# Altium schematic sheet Ext_Mem.SchDoc
size A4; Organization: Altium Limited; Address1: L3, 12a Rodborough Rd; Address2: Frenchs Forest; Address3: NSW; Address4: Australia 2086; DocumentNumber: 2; SheetNumber: 2; SheetTotal: 2
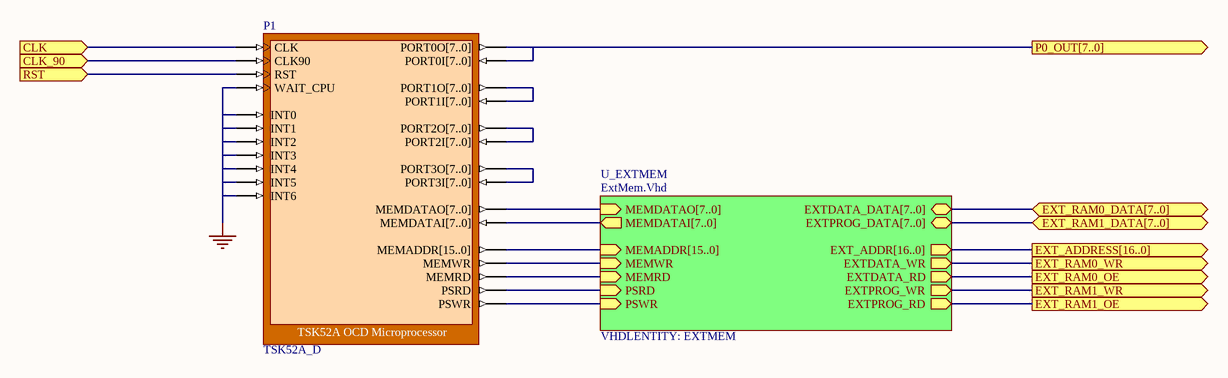
[diagram p0: Ext_Mem.SchDoc]

## Parts
P1  TSK52A_D

## Sub-sheets
U_EXTMEM = ExtMem.Vhd: EXT_ADDR[16..0] (out), EXTDATA_DATA[7..0] (bidir), EXTDATA_RD (out), EXTDATA_WR (out), EXTPROG_DATA[7..0] (bidir), EXTPROG_RD (out), EXTPROG_WR (out), MEMADDR[15..0] (in), MEMDATAI[7..0] (out), MEMDATAO[7..0] (in), MEMRD (in), MEMWR (in), PSRD (in), PSWR (in)  | VHDLENTITY: EXTMEM

## Ports
CLK (in), CLK_90 (in), EXT_ADDRESS[16..0] (out), EXT_RAM0_DATA[7..0] (bidir), EXT_RAM0_OE (out), EXT_RAM0_WR (out), EXT_RAM1_DATA[7..0] (bidir), EXT_RAM1_OE (out), EXT_RAM1_WR (out), P0_OUT[7..0] (out), RST (in)

## Nets
GND: P1.INT0 P1.INT1 P1.INT2 P1.INT3 P1.INT4 P1.INT5 P1.INT6 P1.WAIT_CPU
CLK: P1.CLK ; port CLK
CLK_90: P1.CLK90 ; port CLK_90
EXT_RAM0_OE: port EXT_RAM0_OE, sheet U_EXTMEM/EXTDATA_RD
EXT_RAM0_WR: port EXT_RAM0_WR, sheet U_EXTMEM/EXTDATA_WR
EXT_RAM1_OE: port EXT_RAM1_OE, sheet U_EXTMEM/EXTPROG_RD
EXT_RAM1_WR: port EXT_RAM1_WR, sheet U_EXTMEM/EXTPROG_WR
P0_OUT[7..0]: P1.PORT0I[7..0] P1.PORT0O[7..0] ; port P0_OUT[7..0]
RST: P1.RST ; port RST
NetP1_MEMADDR[15..0]: P1.MEMADDR[15..0] ; sheet U_EXTMEM/MEMADDR[15..0]
NetP1_MEMDATAI[7..0]: P1.MEMDATAI[7..0] ; sheet U_EXTMEM/MEMDATAI[7..0]
NetP1_MEMDATAO[7..0]: P1.MEMDATAO[7..0] ; sheet U_EXTMEM/MEMDATAO[7..0]
NetP1_MEMRD: P1.MEMRD ; sheet U_EXTMEM/MEMRD
NetP1_MEMWR: P1.MEMWR ; sheet U_EXTMEM/MEMWR
NetP1_PORT1I[7..0]: P1.PORT1I[7..0] P1.PORT1O[7..0]
NetP1_PORT2I[7..0]: P1.PORT2I[7..0] P1.PORT2O[7..0]
NetP1_PORT3I[7..0]: P1.PORT3I[7..0] P1.PORT3O[7..0]
NetP1_PSRD: P1.PSRD ; sheet U_EXTMEM/PSRD
NetP1_PSWR: P1.PSWR ; sheet U_EXTMEM/PSWR

## Buses and harness runs
bus port EXT_ADDRESS[16..0] = sheet U_EXTMEM/EXT_ADDR[16..0]
bus port EXT_RAM0_DATA[7..0] = sheet U_EXTMEM/EXTDATA_DATA[7..0]
bus port EXT_RAM1_DATA[7..0] = sheet U_EXTMEM/EXTPROG_DATA[7..0]

## Notes on the sheet
- Title
- Size:
- Date:
- A4
- Number:
- Time:
- Revision:
- Sheet
- of
- File:

## Library data of the parts
P1 = TSK52A_D: TSK52A OCD Microprocessor; NEXUS_CORE: Processor_OCDS; NEXUS_JTAG_DEVICE: True; NEXUS_JTAG_ORDER: 0; ChildModel1: TSK52A_D_DRAM8X256; ChildCore1: M1; Published: 1/12/2003; Publisher: Altium Hobart Technology Centre; Core Revision: 1.00.00